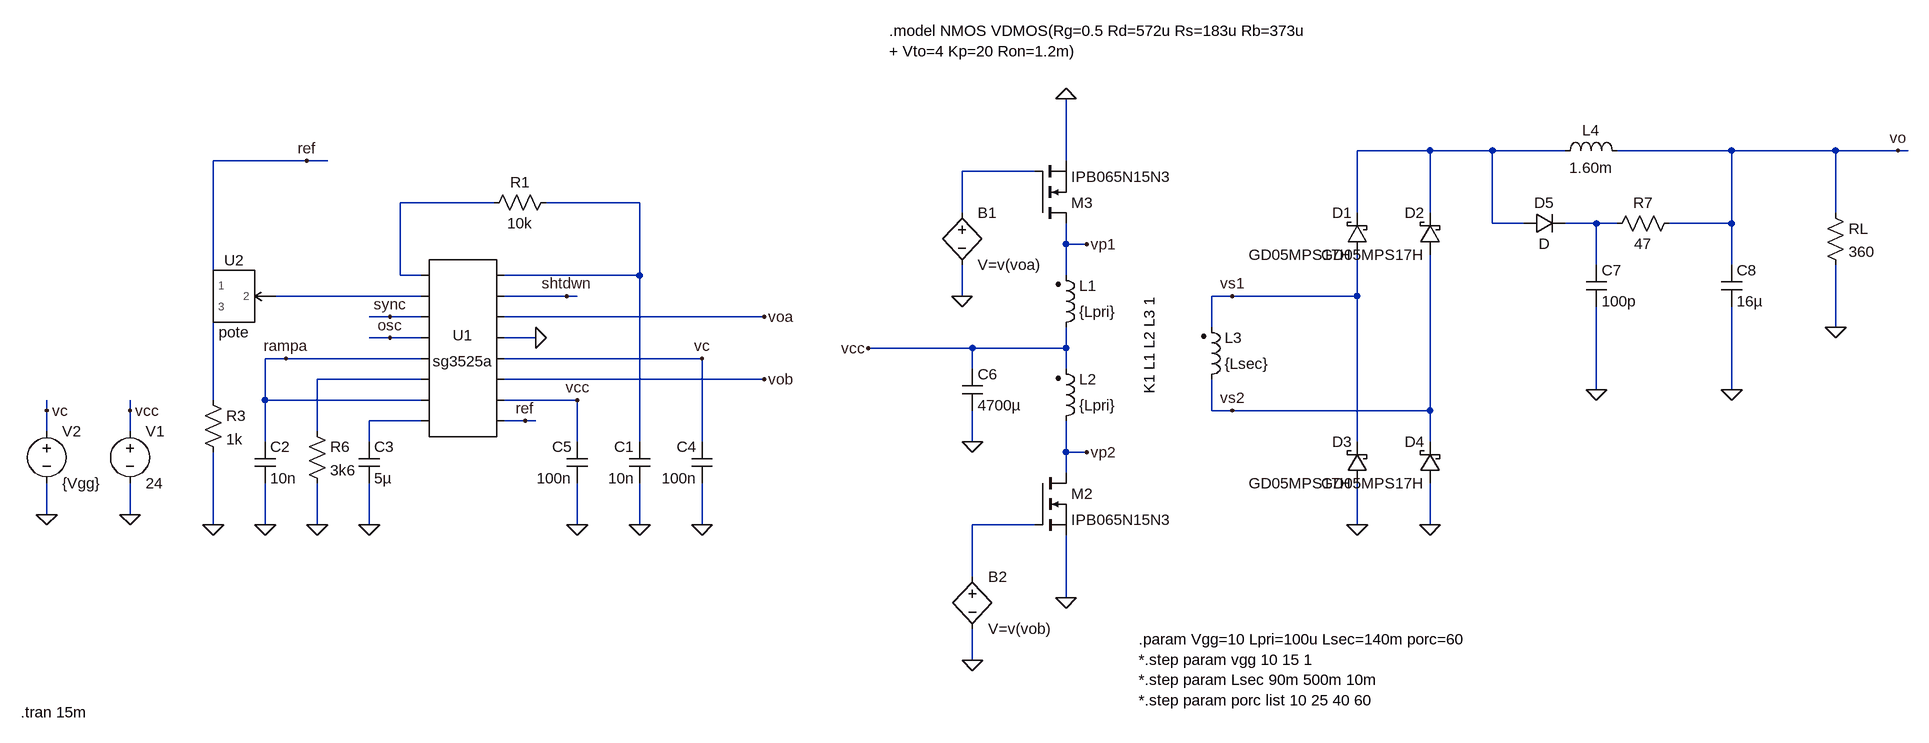
[diagram p0: schematic convDCACDC.asc]
convDCACDC.asc, the LTspice schematic file:
Version 4
SHEET 1 2348 2060
WIRE 576 976 464 976
WIRE 672 976 576 976
WIRE 784 976 672 976
WIRE 1040 976 864 976
WIRE 1200 976 1040 976
WIRE 1296 976 1200 976
WIRE 1312 976 1296 976
WIRE -1152 992 -1296 992
WIRE -1120 992 -1152 992
WIRE 16 992 16 896
WIRE -32 1008 -144 1008
WIRE -864 1056 -1008 1056
WIRE -640 1056 -784 1056
WIRE -144 1072 -144 1008
WIRE 464 1072 464 976
WIRE 576 1072 576 976
WIRE 1200 1072 1200 976
WIRE 672 1088 672 976
WIRE 720 1088 672 1088
WIRE 832 1088 784 1088
WIRE 864 1088 832 1088
WIRE 1040 1088 1040 976
WIRE 1040 1088 944 1088
WIRE 16 1120 16 1088
WIRE 48 1120 16 1120
WIRE 832 1152 832 1088
WIRE 1040 1152 1040 1088
WIRE -1008 1168 -1008 1056
WIRE -976 1168 -1008 1168
WIRE -640 1168 -640 1056
WIRE -640 1168 -848 1168
WIRE 16 1168 16 1120
WIRE -1296 1184 -1296 992
WIRE -976 1200 -1200 1200
WIRE -752 1200 -848 1200
WIRE -736 1200 -752 1200
WIRE -144 1200 -144 1152
WIRE 272 1200 240 1200
WIRE 464 1200 464 1136
WIRE 464 1200 272 1200
WIRE -1024 1232 -1056 1232
WIRE -976 1232 -1024 1232
WIRE -448 1232 -848 1232
WIRE 240 1248 240 1200
WIRE 1200 1248 1200 1152
WIRE -1024 1264 -1056 1264
WIRE -976 1264 -1024 1264
WIRE -800 1264 -848 1264
WIRE -128 1280 -288 1280
WIRE 16 1280 16 1248
WIRE 16 1280 -128 1280
WIRE -1184 1296 -1216 1296
WIRE -976 1296 -1184 1296
WIRE -544 1296 -848 1296
WIRE -128 1312 -128 1280
WIRE 16 1312 16 1280
WIRE -976 1328 -1136 1328
WIRE -448 1328 -848 1328
WIRE 832 1344 832 1216
WIRE 1040 1344 1040 1216
WIRE -1296 1360 -1296 1216
WIRE -1216 1360 -1216 1296
WIRE -976 1360 -1216 1360
WIRE -736 1360 -848 1360
WIRE -1552 1376 -1552 1360
WIRE -1424 1376 -1424 1360
WIRE 240 1376 240 1328
WIRE 272 1376 240 1376
WIRE 576 1376 576 1136
WIRE 576 1376 272 1376
WIRE -976 1392 -1056 1392
WIRE -816 1392 -848 1392
WIRE -800 1392 -816 1392
WIRE -1552 1408 -1552 1376
WIRE -1424 1408 -1424 1376
WIRE -1136 1408 -1136 1328
WIRE -1216 1424 -1216 1360
WIRE -1056 1424 -1056 1392
WIRE -736 1424 -736 1360
WIRE -640 1424 -640 1168
WIRE -544 1424 -544 1296
WIRE -128 1424 -128 1376
WIRE 464 1424 464 1200
WIRE 576 1424 576 1376
WIRE 16 1440 16 1392
WIRE 48 1440 16 1440
WIRE 16 1472 16 1440
WIRE -1552 1536 -1552 1488
WIRE -1424 1536 -1424 1488
WIRE -1296 1552 -1296 1440
WIRE -1216 1552 -1216 1488
WIRE -1136 1552 -1136 1488
WIRE -1056 1552 -1056 1488
WIRE -736 1552 -736 1488
WIRE -640 1552 -640 1488
WIRE -544 1552 -544 1488
WIRE -32 1552 -128 1552
WIRE 464 1552 464 1488
WIRE 576 1552 576 1488
WIRE -128 1632 -128 1552
WIRE 16 1664 16 1568
WIRE -128 1760 -128 1712
FLAG -640 1552 0
FLAG -1296 1552 0
FLAG -1216 1552 0
FLAG -1136 1552 0
FLAG -1056 1552 0
FLAG -816 1392 ref
FLAG -448 1232 voa
FLAG -448 1328 vob
FLAG -800 1264 0
FLAG -544 1552 0
FLAG -544 1296 vc
FLAG -736 1552 0
FLAG -1152 992 ref
FLAG -1024 1232 sync
FLAG -1024 1264 osc
FLAG -1184 1296 rampa
FLAG -736 1360 vcc
FLAG -1424 1536 0
FLAG -1424 1376 vcc
FLAG -1552 1536 0
FLAG -1552 1376 vc
FLAG -752 1200 shtdwn
FLAG -128 1424 0
FLAG 464 1552 0
FLAG 576 1552 0
FLAG 1040 1344 0
FLAG 832 1344 0
FLAG -288 1280 vcc
FLAG 48 1120 vp1
FLAG 272 1200 vs1
FLAG 272 1376 vs2
FLAG 16 896 0
FLAG 48 1440 vp2
FLAG 16 1664 0
FLAG -144 1200 0
FLAG -128 1760 0
FLAG 1200 1248 0
FLAG 1296 976 vo
SYMBOL AutoGenerated\\sg3525a -912 1280 R0
SYMATTR InstName U1
SYMBOL res -768 1040 R90
WINDOW 0 0 56 VBottom 2
WINDOW 3 32 56 VTop 2
SYMATTR InstName R1
SYMATTR Value 10k
SYMBOL cap -624 1488 R180
WINDOW 0 24 56 Left 2
WINDOW 3 24 8 Left 2
SYMATTR InstName C1
SYMATTR Value 10n
SYMBOL cap -1232 1424 R0
SYMATTR InstName C2
SYMATTR Value 10n
SYMBOL res -1152 1392 R0
SYMATTR InstName R6
SYMATTR Value 3k6
SYMBOL cap -1072 1424 R0
SYMATTR InstName C3
SYMATTR Value 5µ
SYMBOL cap -528 1488 R180
WINDOW 0 24 56 Left 2
WINDOW 3 24 8 Left 2
SYMATTR InstName C4
SYMATTR Value 100n
SYMBOL cap -720 1488 R180
WINDOW 0 24 56 Left 2
WINDOW 3 24 8 Left 2
SYMATTR InstName C5
SYMATTR Value 100n
SYMBOL voltage -1424 1392 R0
WINDOW 123 0 0 Left 0
WINDOW 39 0 0 Left 0
SYMATTR InstName V1
SYMATTR Value 24
SYMBOL voltage -1552 1392 R0
WINDOW 123 0 0 Left 0
WINDOW 39 0 0 Left 0
SYMATTR InstName V2
SYMATTR Value {Vgg}
SYMBOL cap -144 1312 R0
SYMATTR InstName C6
SYMATTR Value 4700µ
SYMBOL ind2 0 1264 M180
WINDOW 0 36 80 Left 2
WINDOW 3 36 40 Left 2
SYMATTR InstName L1
SYMATTR Value {Lpri}
SYMATTR Type ind
SYMATTR SpiceLine Rser=.1
SYMBOL ind2 0 1408 M180
WINDOW 0 36 80 Left 2
WINDOW 3 36 40 Left 2
SYMATTR InstName L2
SYMATTR Value {Lpri}
SYMATTR Type ind
SYMATTR SpiceLine Rser=.1
SYMBOL ind2 224 1344 M180
WINDOW 0 36 80 Left 2
WINDOW 3 36 40 Left 2
SYMATTR InstName L3
SYMATTR Value {Lsec}
SYMATTR Type ind
SYMBOL diode 720 1104 R270
WINDOW 0 32 32 VTop 2
WINDOW 3 0 32 VBottom 2
SYMATTR InstName D5
SYMBOL ind 768 992 R270
WINDOW 0 32 56 VTop 2
WINDOW 3 5 56 VBottom 2
SYMATTR InstName L4
SYMATTR Value 1.60m
SYMBOL res 960 1072 R90
WINDOW 0 0 56 VBottom 2
WINDOW 3 32 56 VTop 2
SYMATTR InstName R7
SYMATTR Value 47
SYMBOL cap 816 1152 R0
SYMATTR InstName C7
SYMATTR Value 100p
SYMBOL cap 1024 1152 R0
SYMATTR InstName C8
SYMATTR Value 16µ
SYMBOL schottky 480 1136 R180
WINDOW 0 24 64 Left 2
WINDOW 3 24 0 Left 2
SYMATTR InstName D1
SYMATTR Value GD05MPS17H
SYMATTR Description Diode
SYMATTR Type diode
SYMBOL AutoGenerated\\pote -1264 1216 M0
SYMATTR InstName U2
SYMATTR SpiceLine R=10k porc23={porc}
SYMBOL bv -144 1056 R0
SYMATTR InstName B1
SYMATTR Value V=v(voa)
SYMBOL bv -128 1616 R0
SYMATTR InstName B2
SYMATTR Value V=v(vob)
SYMBOL res 1184 1056 R0
SYMATTR InstName RL
SYMATTR Value 360
SYMBOL res -1312 1344 R0
SYMATTR InstName R3
SYMATTR Value 1k
SYMBOL nmos -32 1472 R0
SYMATTR InstName M2
SYMATTR Value IPB065N15N3
SYMBOL nmos -32 1088 M180
SYMATTR InstName M3
SYMATTR Value IPB065N15N3
SYMBOL schottky 592 1136 R180
WINDOW 0 24 64 Left 2
WINDOW 3 24 0 Left 2
SYMATTR InstName D2
SYMATTR Value GD05MPS17H
SYMATTR Description Diode
SYMATTR Type diode
SYMBOL schottky 480 1488 R180
WINDOW 0 24 64 Left 2
WINDOW 3 24 0 Left 2
SYMATTR InstName D3
SYMATTR Value GD05MPS17H
SYMATTR Description Diode
SYMATTR Type diode
SYMBOL schottky 592 1488 R180
WINDOW 0 24 64 Left 2
WINDOW 3 24 0 Left 2
SYMATTR InstName D4
SYMATTR Value GD05MPS17H
SYMATTR Description Diode
SYMATTR Type diode
TEXT 128 1728 Left 2 !.param Vgg=10 Lpri=100u Lsec=140m porc=60\n*.step param vgg 10 15 1\n*.step param Lsec 90m 500m 10m\n*.step param porc list 10 25 40 60
TEXT 144 1200 VRight 2 !K1 L1 L2 L3 1
TEXT -256 792 Left 2 !.model NMOS VDMOS(Rg=0.5 Rd=572u Rs=183u Rb=373u \n+ Vto=4 Kp=20 Ron=1.2m)
TEXT -1592 1840 Left 2 !.tran 15m

The netlist it stands for:
* convDCACDC.asc
* U1: sg3525a (symbol AutoGenerated\sg3525a not available, pins judged from their places): pin1=N003 pin2=N006 pin3=sync pin4=osc pin5=rampa pin6=N007 pin7=rampa pin8=N009 pin9=N004 pin10=shtdwn pin11=voa pin12=0 pin13=vc pin14=vob pin15=vcc pin16=ref
R1 N004 N003 10k
C1 0 N004 10n
C2 rampa 0 10n
R6 N007 0 3k6
C3 N009 0 5µ
C4 0 vc 100n
C5 0 vcc 100n
V1 vcc 0 24
V2 vc 0 {Vgg}
C6 vcc 0 4700µ
L1 vcc vp1 {Lpri} Rser=.1
L2 vp2 vcc {Lpri} Rser=.1
L3 vs2 vs1 {Lsec}
D5 N001 N005 D
L4 N001 vo 1.60m
R7 vo N005 47
C7 N005 0 100p
C8 vo 0 16µ
D1 vs1 N001 GD05MPS17H
XU2 ref N006 N008 pote R=10k porc23={porc}  ; pins 1 2 3
B1 N002 0 V=v(voa)
B2 N010 0 V=v(vob)
RL vo 0 360
R3 N008 0 1k
M2 vp2 N010 0 0 IPB065N15N3
M3 vp1 N002 0 0 IPB065N15N3
D2 vs2 N001 GD05MPS17H
D3 0 vs1 GD05MPS17H
D4 0 vs2 GD05MPS17H
.model D D
.lib standard.dio
.model NMOS NMOS
.model PMOS PMOS
.lib standard.mos
.param Vgg=10 Lpri=100u Lsec=140m porc=60
*.step param vgg 10 15 1
*.step param Lsec 90m 500m 10m
*.step param porc list 10 25 40 60
K1 L1 L2 L3 1
.model NMOS VDMOS(Rg=0.5 Rd=572u Rs=183u Rb=373u
+ Vto=4 Kp=20 Ron=1.2m)
.tran 15m
.lib Z:\UNC\2022\powerElectronics\TPT5\sim\pote.cir
.backanno
.end